# EAGLE design Beagle Cape (EAGLE 5.11)
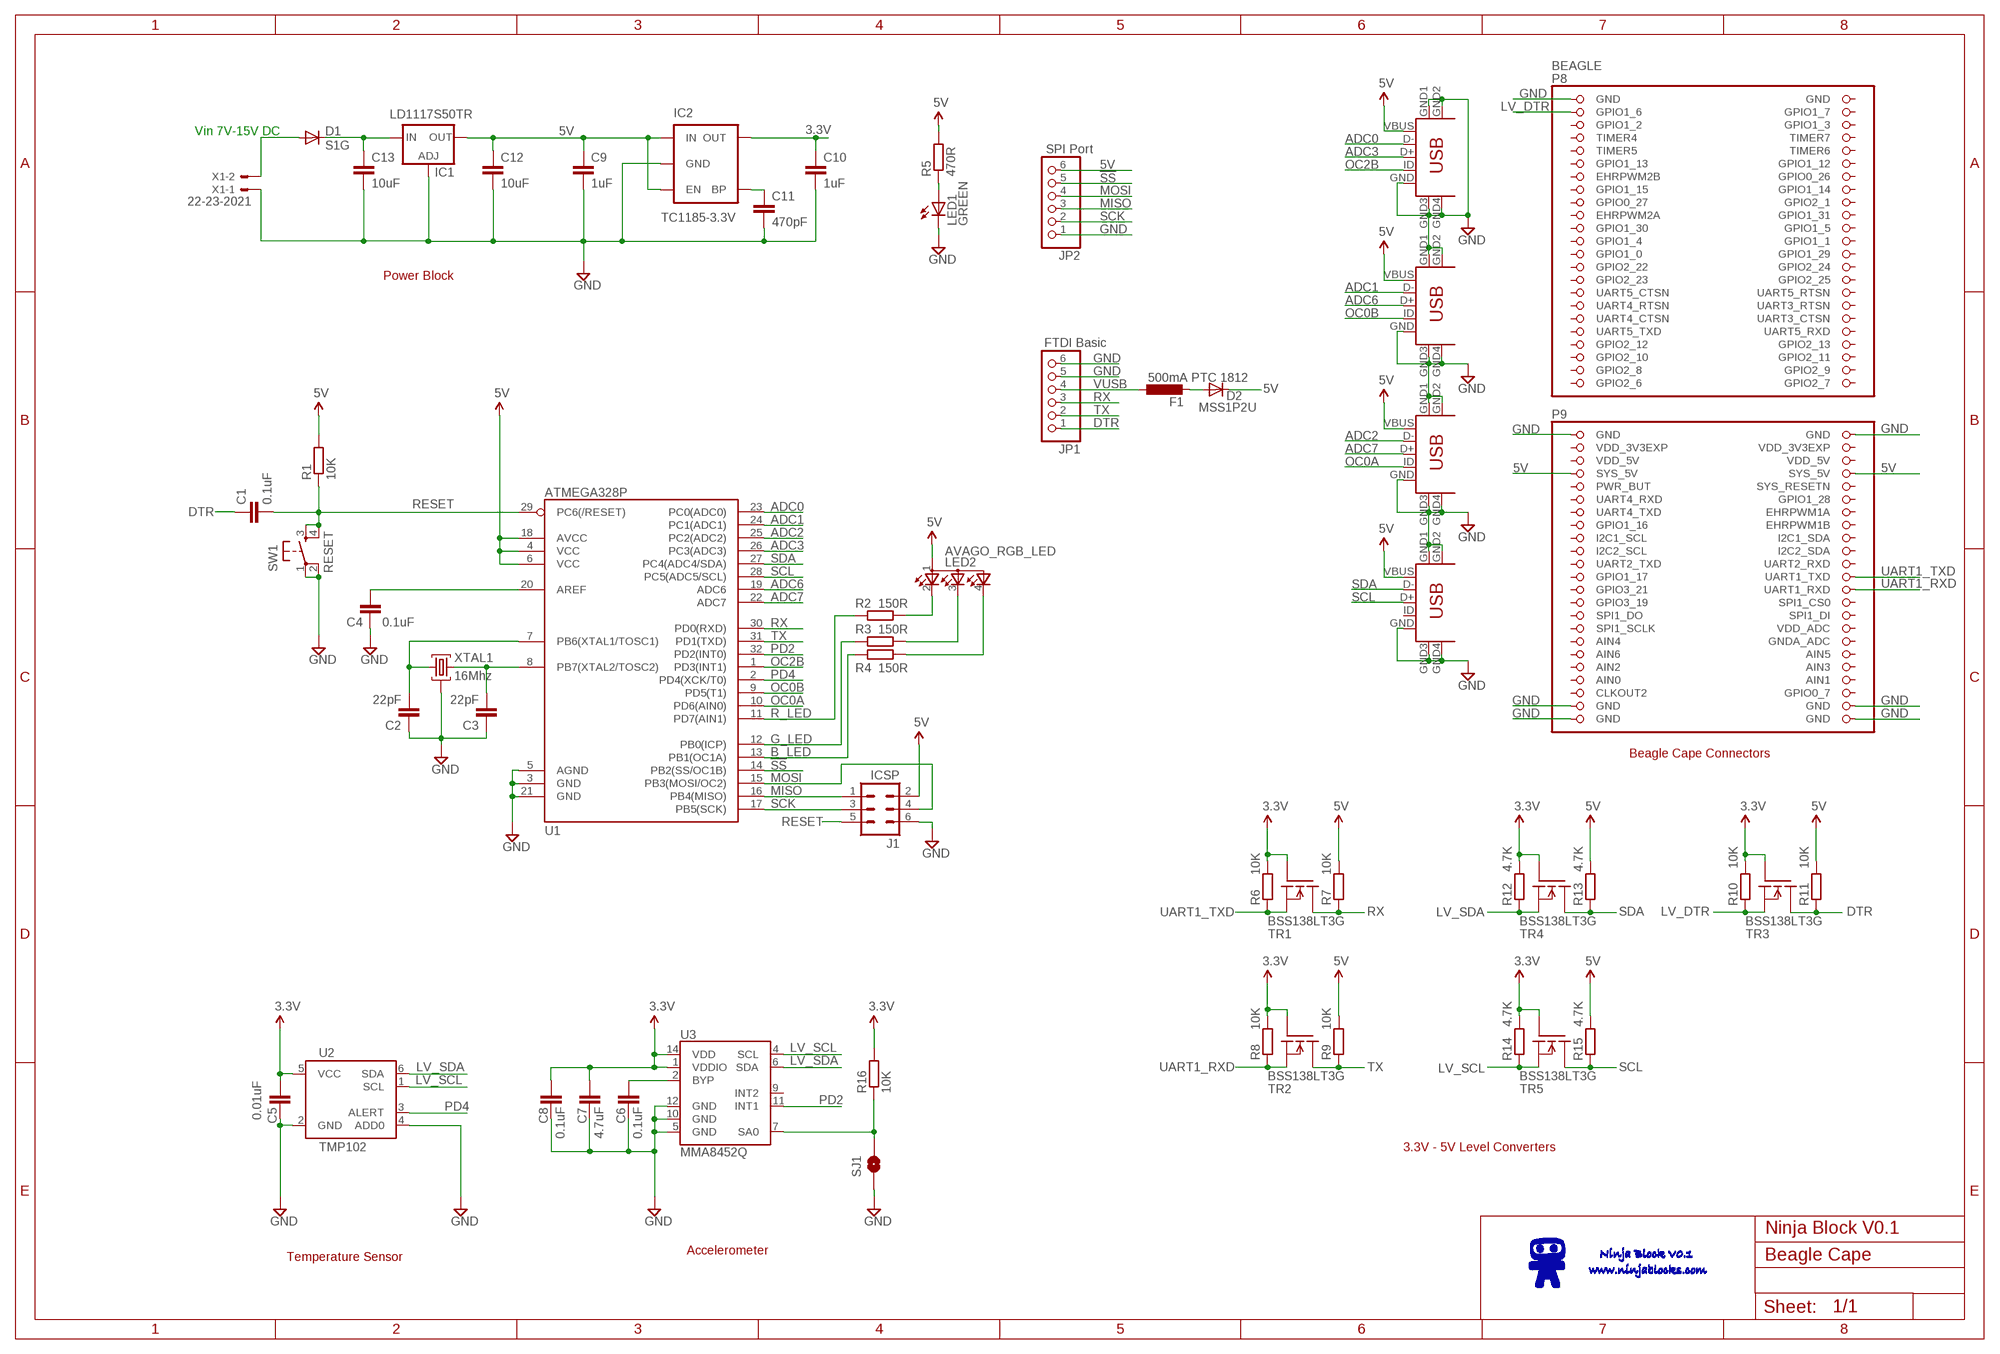
[diagram p0: schematic, sheet 1]

## Parts
BEAGLE  BEAGLEBONE_OUTLINE  [BEAGLEBONE_SHIELD]
C1  0.1uF  C-EUC0603  [C0603]
C2  22pF  C-EUC0603  [C0603]
C3  22pF  C-EUC0603  [C0603]
C4  0.1uF  C-EUC0603  [C0603]
C5  0.01uF  C-EUC0603  [C0603]
C6  0.1uF  C-EUC0603  [C0603]
C7  4.7uF  C-EUC0603  [C0603]
C8  0.1uF  C-EUC0603  [C0603]
C9  1uF  C-EUC0603  [C0603]
C10  1uF  C-EUC0603  [C0603]
C11  470pF  C-EUC0603  [C0603]
C12  10uF  C-EUC0603  [C0603]
C13  10uF  C-EUC1206  [C1206]
CON1  USB-MINIB  [MOLEX_MINIUSB_B]
CON2  USB-MINIB  [MOLEX_MINIUSB_B]
CON3  USB-MINIB  [MOLEX_MINIUSB_B]
D1  S1G  DIODESMA  [SMA-DIODE]
D2  MSS1P2U  [MICROSMP]
F1  500mA PTC 1812  L-EUL1812  [L1812]
I2C  USB-MINIB  [MOLEX_MINIUSB_B]
IC1  LD1117S50TR  LD117AS50TR  [SOT223]
IC2  TC1185-3.3V  V_REG_LDOSMD  [SOT23-5]
J1  ICSP  MA03-2  [MA03-2]
JP1  FTDI Basic  PINHD-1X6  [1X06]
JP2  SPI Port  PINHD-1X6  [1X06]
LED1  GREEN  LEDCHIPLED_0603  [CHIPLED_0603]
LED2  AVAGO_RGB_LED  [AVAGO_LED]
R1  10K  R-EU_R0603  [R0603]
R2  150R  R-EU_R0603  [R0603]
R3  150R  R-EU_R0603  [R0603]
R4  150R  R-EU_R0603  [R0603]
R5  470R  R-EU_R0603  [R0603]
R6  10K  R-EU_R0603  [R0603]
R7  10K  R-EU_R0603  [R0603]
R8  10K  R-EU_R0603  [R0603]
R9  10K  R-EU_R0603  [R0603]
R10  10K  R-EU_R0603  [R0603]
R11  10K  R-EU_R0603  [R0603]
R12  4.7K  R-EU_R0603  [R0603]
R13  4.7K  R-EU_R0603  [R0603]
R14  4.7K  R-EU_R0603  [R0603]
R15  4.7K  R-EU_R0603  [R0603]
R16  10K  R-EU_R0603  [R0603]
SJ1  SOLDERJUMPERNO  [SJ_2S-NO]
SW1  RESET  ALPS_SMD_TAC_SWITCH  [ALPS_SMD_TAC_SWITCH]
TR1  BSS138LT3G  IRLML2502PBF  [SOT23]
TR2  BSS138LT3G  IRLML2502PBF  [SOT23]
TR3  BSS138LT3G  IRLML2502PBF  [SOT23]
TR4  BSS138LT3G  IRLML2502PBF  [SOT23]
TR5  BSS138LT3G  IRLML2502PBF  [SOT23]
U1  ATMEGA328P  ATMEGA168  [TQFP32-08]
U2  TMP102  [SOT563]
U3  MMA8452Q  [QFN-16_0.5MM]
X1  22-23-2021  [22-23-2021]
XTAL1  16Mhz  12MHZ  [HC49US-G]

## Nets
3.3V: C5.2 C7.2 C8.2 C10.1 IC2.5(OUT) R6.1 R8.1 R10.1 R12.1 R14.1 R16.2 TR1.1(G) TR2.1(G) TR3.1(G) TR4.1(G) TR5.1(G) U2.5(VCC) U3.1(VDDIO) U3.14(VDD)
5V: BEAGLE.53(SYS_5V) BEAGLE.54(SYS_5V) C9.1 C12.1 CON1.VBUS CON2.VBUS CON3.VBUS D2.C I2C.VBUS IC1.4(OUT) IC2.1(IN) IC2.3(EN) J1.2 JP2.6 LED2.1(A1) R1.2 R5.2 R7.1 R9.1 R11.1 R13.1 R15.1 U1.4(VCC) U1.6(VCC) U1.18(AVCC)
!SS!: JP2.5 U1.14(PB2(SS/OC1B))
ADC0: CON1.D- U1.23(PC0(ADC0))
ADC1: CON2.D- U1.24(PC1(ADC1))
ADC2: CON3.D- U1.25(PC2(ADC2))
ADC3: CON1.D+ U1.26(PC3(ADC3))
ADC6: CON2.D+ U1.19(ADC6)
ADC7: CON3.D+ U1.22(ADC7)
B_LED: R4.2 U1.13(PB1(OC1A))
DTR: C1.1 JP1.1 R11.2 TR3.3(D)
G_LED: R3.2 U1.12(PB0(ICP))
GND: BEAGLE.1(GND) BEAGLE.47(GND) BEAGLE.48(GND) BEAGLE.89(GND) BEAGLE.90(GND) BEAGLE.91(GND) BEAGLE.92(GND) C2.1 C3.1 C4.1 C5.1 C6.1 C7.1 C8.1 C9.2 C10.2 C11.2 C12.2 C13.2 CON1.GND CON1.GND1(MTN1) CON1.GND2(MTN2) CON1.GND3(MTN3) CON1.GND4(MTN4) CON2.GND CON2.GND1(MTN1) CON2.GND2(MTN2) CON2.GND3(MTN3) CON2.GND4(MTN4) CON3.GND CON3.GND1(MTN1) CON3.GND2(MTN2) CON3.GND3(MTN3) CON3.GND4(MTN4) I2C.GND I2C.GND1(MTN1) I2C.GND2(MTN2) I2C.GND3(MTN3) I2C.GND4(MTN4) IC1.1(ADJ) IC2.2(GND) J1.6 JP1.5 JP1.6 JP2.1 LED1.C SJ1.1 SW1.1 SW1.2 U1.3(GND) U1.5(AGND) U1.21(GND) U2.2(GND) U2.4(ADD0) U3.5(GND) U3.10(GND) U3.12(GND) X1.1 XTAL1.GND
LV_DTR: BEAGLE.3(GPIO1_6) R10.2 TR3.2(S)
LV_SCL: R14.2 TR5.2(S) U2.1(SCL) U3.4(SCL)
LV_SDA: R12.2 TR4.2(S) U2.6(SDA) U3.6(SDA)
MISO: J1.1 JP2.3 U1.16(PB4(MISO))
MOSI: J1.4 JP2.4 U1.15(PB3(MOSI/OC2))
N$1: C2.2 U1.7(PB6(XTAL1/TOSC1)) XTAL1.1
N$2: LED2.2(R2) R2.1
N$3: C3.2 U1.8(PB7(XTAL2/TOSC2)) XTAL1.2
N$4: C4.2 U1.20(AREF)
N$5: LED2.3(G3) R3.1
N$6: LED2.4(B4) R4.1
N$9: R16.1 SJ1.2 U3.7(SA0)
N$10: C11.1 IC2.4(BP)
N$11: LED1.A R5.1
N$12: C13.1 D1.C IC1.3(IN)
N$13: C6.2 U3.2(BYP)
N$15: D1.A X1.2
N$16: D2.A F1.2
OC0A: CON3.ID U1.10(PD6(AIN0))
OC0B: CON2.ID U1.9(PD5(T1))
OC2B: CON1.ID U1.1(PD3(INT1))
PD2: U1.32(PD2(INT0)) U3.11(INT1)
PD4: U1.2(PD4(XCK/T0)) U2.3(ALERT)
R_LED: R2.2 U1.11(PD7(AIN1))
RESET: C1.2 J1.5 R1.1 SW1.3 SW1.4 U1.29(PC6(/RESET))
RX: JP1.3 R7.2 TR1.3(D) U1.30(PD0(RXD))
SCK: J1.3 JP2.2 U1.17(PB5(SCK))
SCL: I2C.D+ R15.2 TR5.3(D) U1.28(PC5(ADC5/SCL))
SDA: I2C.D- R13.2 TR4.3(D) U1.27(PC4(ADC4/SDA))
TX: JP1.2 R9.2 TR2.3(D) U1.31(PD1(TXD))
UART1_RXD: BEAGLE.72(UART1_RXD) R8.2 TR2.2(S)
UART1_TXD: BEAGLE.70(UART1_TXD) R6.2 TR1.2(S)
VUSB: F1.1 JP1.4
Unconnected: BEAGLE.5(GPIO1_2) BEAGLE.6(GPIO1_3) BEAGLE.7(TIMER4) BEAGLE.8(TIMER7) BEAGLE.9(TIMER5) BEAGLE.10(TIMER6) BEAGLE.11(GPIO1_13) BEAGLE.12(GPIO1_12) BEAGLE.13(EHRPWM2B) BEAGLE.14(GPIO0_26) BEAGLE.15(GPIO1_15) BEAGLE.16(GPIO1_14) BEAGLE.17(GPIO0_27) BEAGLE.18(GPIO2_1) BEAGLE.19(EHRPWM2A) BEAGLE.20(GPIO1_31) BEAGLE.21(GPIO1_30) BEAGLE.22(GPIO1_5) BEAGLE.23(GPIO1_4) BEAGLE.24(GPIO1_1) BEAGLE.25(GPIO1_0) BEAGLE.26(GPIO1_29) BEAGLE.27(GPIO2_22) BEAGLE.28(GPIO2_24) BEAGLE.29(GPIO2_23) BEAGLE.30(GPIO2_25) BEAGLE.31(UART5_CTSN) BEAGLE.32(UART5_RTSN) BEAGLE.33(UART4_RTSN) BEAGLE.34(UART3_RTSN) BEAGLE.35(UART4_CTSN) BEAGLE.36(UART3_CTSN) BEAGLE.37(UART5_TXD) BEAGLE.38(UART5_RXD) BEAGLE.39(GPIO2_12) BEAGLE.40(GPIO2_13) BEAGLE.41(GPIO2_10) BEAGLE.55(PWR_BUT) BEAGLE.56(SYS_RESETN) BEAGLE.57(UART4_RXD) BEAGLE.58(GPIO1_28) BEAGLE.59(UART4_TXD) BEAGLE.60(EHRPWM1A) BEAGLE.61(GPIO1_16) BEAGLE.62(EHRPWM1B) BEAGLE.63(I2C1_SCL) BEAGLE.64(I2C1_SDA) BEAGLE.65(I2C2_SCL) BEAGLE.66(I2C2_SDA) BEAGLE.67(UART2_TXD) BEAGLE.68(UART2_RXD) BEAGLE.69(GPIO1_17) BEAGLE.71(GPIO3_21) BEAGLE.73(GPIO3_19) BEAGLE.74(SPI1_CS0) BEAGLE.75(SPI1_DO) BEAGLE.76(SPI1_DI) BEAGLE.77(SPI1_SCLK) BEAGLE.78(VDD_ADC) BEAGLE.79(AIN4) BEAGLE.80(GNDA_ADC) BEAGLE.81(AIN6) BEAGLE.82(AIN5) BEAGLE.83(AIN2) BEAGLE.86(AIN1) BEAGLE.87(CLKOUT2) BEAGLE.88(GPIO0_7) I2C.ID U3.9(INT2)

## Notes on the sheet
- Vin 7V-15V DC
- Power Block
- Beagle Cape Connectors
- 3.3V - 5V Level Converters
- Ninja Block V0.1
- Accelerometer
- Temperature Sensor

## Power pins joined to a net without a drawn wire
AIN0: BEAGLE.85(AIN0)
AIN3: BEAGLE.84(AIN3)
GND: BEAGLE.2(GND)
GPIO1_7: BEAGLE.4(GPIO1_7)
GPIO2_6: BEAGLE.45(GPIO2_6)
GPIO2_7: BEAGLE.46(GPIO2_7)
GPIO2_8: BEAGLE.43(GPIO2_8)
GPIO2_9: BEAGLE.44(GPIO2_9)
GPIO2_11: BEAGLE.42(GPIO2_11)
VDD_3V3EXP: BEAGLE.49(VDD_3V3EXP) BEAGLE.50(VDD_3V3EXP)
VDD_5V: BEAGLE.51(VDD_5V) BEAGLE.52(VDD_5V)

## Library data of the parts
BEAGLE = adafruit:BEAGLEBONE_OUTLINE: Should match A3 pinout - but not completely tested
C1-C13 = rcl:C-EU: CAPACITOR, European symbol
CON1-CON3 I2C = SparkFun:USB-MINIB: Mini-USB "B" connector with 5th pin broken out. Created new symbol breaking out 5th "ID" pin in mini/micro USB connector spec. See: http://en.wikipedia.org/wiki/Mini_usb#Cables. Uses same footprint as 4-pin symbol. Also added pins to connect to mounting / shield pads if required (probably not generally needed as signals aren't shielded once they leave the connector).
D1 = SparkFun:DIODE: Diode These are standard reverse protection diodes and small signal diodes. SMA package can handle up to about 1A. SOD-323 can handle about 200mA. What the SOD-323 package when ordering, there are some mfgs out there that are 5-pin packages.
D2 = Monkey:MSS1P2U: MSS1P2U-M3/89A Schottky Rectifier Datasheet : http://www.vishay.com/docs/89020/mss1p3l.pdf
F1 = rcl:L-EU: INDUCTOR, European symbol
IC1 = v-reg:LD117A?*: Low drop fixed and adjustable positive voltage regulators 1 A Source: http://www.st.com/stonline/products/literature/ds/7194/ld1117axx.pdf
IC2 = SparkFun:V_REG_LDO: Voltage Regulator LDO Standard 150mA LDO voltage regulator in SOT-23 layout. Micrel part MIC5205. BP (by-pass) pin is used to lower output noise with 470pF cap.
J1 = con-lstb:MA03-2: PIN HEADER; OC_FARNELL: unknown; OC_NEWARK: unknown
JP1 JP2 = pinhead:PINHD-1X6: PIN HEADER
LED1 = led:LED: LED OSRAM: - CHIPLED LG R971, LG N971, LY N971, LG Q971, LY Q971, LO R971, LY R971 LH N974, LH R974 LS Q976, LO Q976, LY Q976 LO Q996 - Hyper CHIPLED LW Q18S LB Q993, LB Q99A, LB R99A - SideLED LS A670, LO A670, LY A670, LG A670, LP A670 LB A673, LV A673, LT A673, LW A673 LH A674 LY A675 LS A676, LA A676, LO A676, LY A676, LW A676 LS A679, LY A679, LG A679 - Hyper Micro SIDELED® LS Y876, LA Y876, LO Y876, LY Y876 LT Y87S - SmartLED LW L88C, LW L88S LB L89C, LB L89S, LG L890 LS L89K, LO L89K, LY L89K LS L896, LA L896, LO L896, LY L896 - TOPLED LS T670, LO T670, LY T670, LG T670, LP T670 LSG T670, LSP T670, LSY T670, LOP T670, LYG T670 LG T671, LOG T671, LSG T671 LB T673, LV T673, LT T673, LW T673 LH T674 LS T676, LA T676, LO T676, LY T676, LB T676, LH T676, LSB T676, LW T676 LB T67C, LV T67C, LT T67C, LS T67K, LO T67K, LY T67K, LW E67C LS E67B, LA E67B, LO E67B, LY E67B, LB E67C, LV E67C, LT E67C LW T67C LS T679, LY T679, LG T679 LS T770, LO T770, LY T770, LG T770, LP T770 LB T773, LV T773, LT T773, LW T773 LH T774 LS E675, LA E675, LY E675, LS T675 LS T776, LA T776, LO T776, LY T776, LB T776 LHGB T686 LT T68C, LB T68C - Hyper Mini TOPLED® LB M676 - Mini TOPLED Santana® LG M470 LS M47K, LO M47K, LY M47K Source: http://www.osram.convergy.de LUXEON: - LUMILED® LXK2-PW12-R00, LXK2-PW12-S00, LXK2-PW14-U00, LXK2-PW14-V00 LXK2-PM12-R00, LXK2-PM12-S00, LXK2-PM14-U00 LXK2-PE12-Q00, LXK2-PE12-R00, LXK2-PE12-S00, LXK2-PE14-T00, LXK2-PE14-U00 LXK2-PB12-K00, LXK2-PB12-L00, LXK2-PB12-M00, LXK2-PB14-N00, LXK2-PB14-P00, LXK2-PB14-Q00 LXK2-PR12-L00, LXK2-PR12-M00, LXK2-PR14-Q00, LXK2-PR14-R00 LXK2-PD12-Q00, LXK2-PD12-R00, LXK2-PD12-S00 LXK2-PH12-R00, LXK2-PH12-S00 LXK2-PL12-P00, LXK2-PL12-Q00, LXK2-PL12-R00 Source: www.luxeon.com KINGBRIGHT: KA-3528ASYC Source: www.kingbright.com
LED2 = Monkey:AVAGO_RGB_LED
R1-R16 = resistor:R-EU_: RESISTOR, European symbol
SJ1 = SparkFun:SOLDERJUMPER: Solder Jumper Standard SMD solder jumper. Used to automate production. Two varients : Normally Open and Normally Closed are the same, but have different paste layers. NC will have a large amount of paste and should jumper during reflow.
SW1 = Monkey:ALPS_SMD_TAC_SWITCH: ALPS SMD Tactile Switch SKQGAKE010 Source : http://www.farnell.com/datasheets/78970.pdf
TR1-TR5 = Monkey:IRLML2502PBF: IRLML2502 N-Channel HexFet Power Mosfet Datasheet : http://www.irf.com/product-info/datasheets/data/irlml2502pbf.pdf
U1 = SparkFun:ATMEGA168
U2 = SparkFun:TMP102
U3 = SparkFun:MMA8452Q: MMA8452Q 3-Axis, 12/8-bit Digital Accelerometer Supply Voltage: 1.6-3.6V Range: +/- 2g, 4g, 8g Interface: I2C, 12-bit and 8-bit ODR: 1.56 Hz - 800 Hz Package: QFN-16 http://cache.freescale.com/files/sensors/doc/data_sheet/MMA8452Q.pdf
X1 = con-molex:22-23-2021: .100" (2.54mm) Center Header - 2 Pin; MF: MOLEX; MPN: 22-23-2021; OC_FARNELL: 1462926; OC_NEWARK: 25C3832
XTAL1 = Monkey:12MHZ: HC/49US (AT49) 3RD LEAD CASE-GROUNDED SMD LOW PROFILE CRYSTAL CRYSTAL, 12MHz, 18pF, HC-49/US Source : http://www.abracon.com/Resonators/ABLSG.pdf

## Board
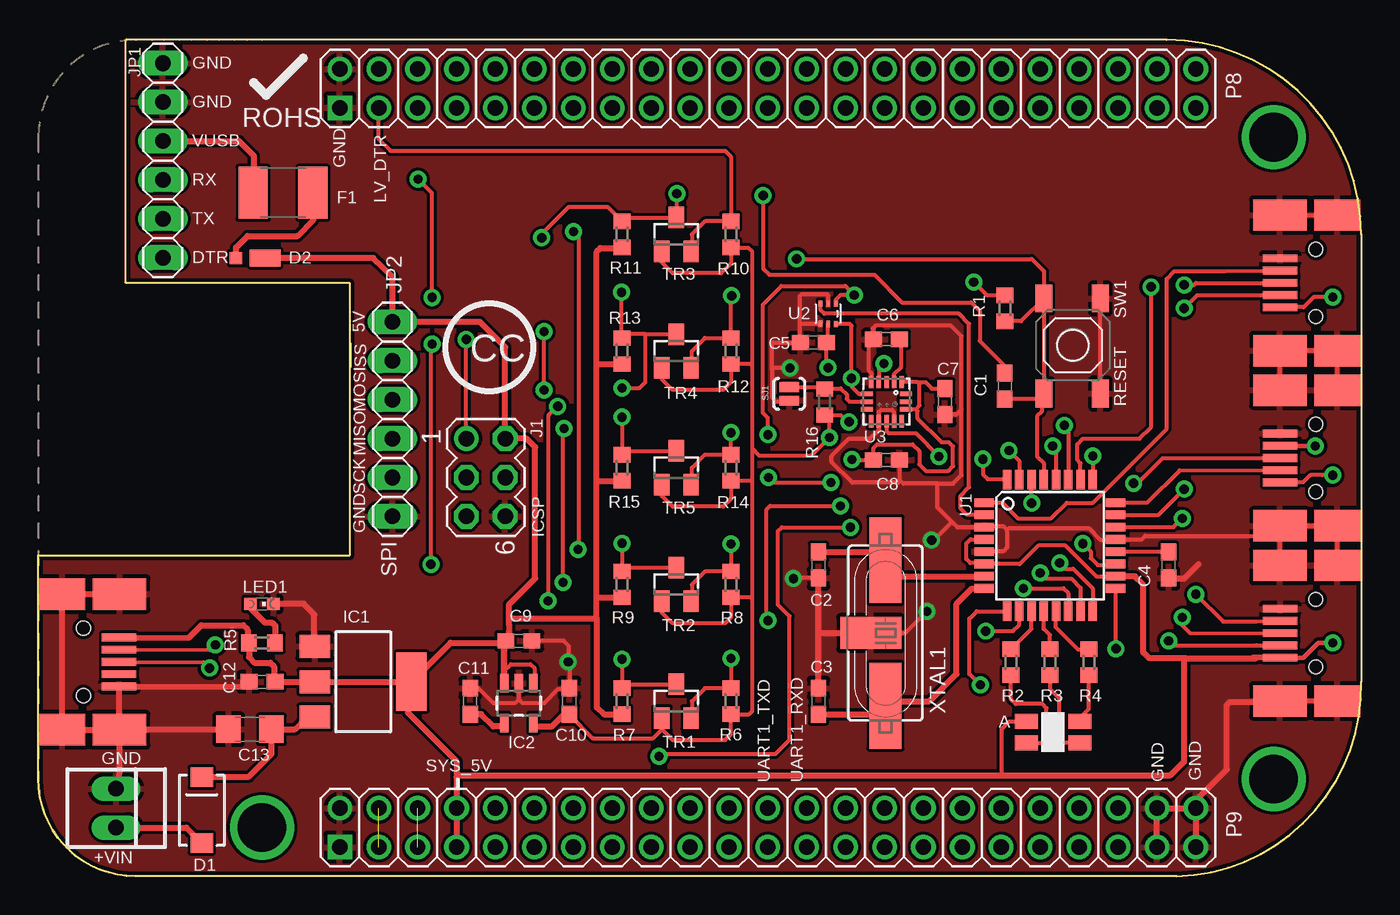
[diagram p1: board, top side]
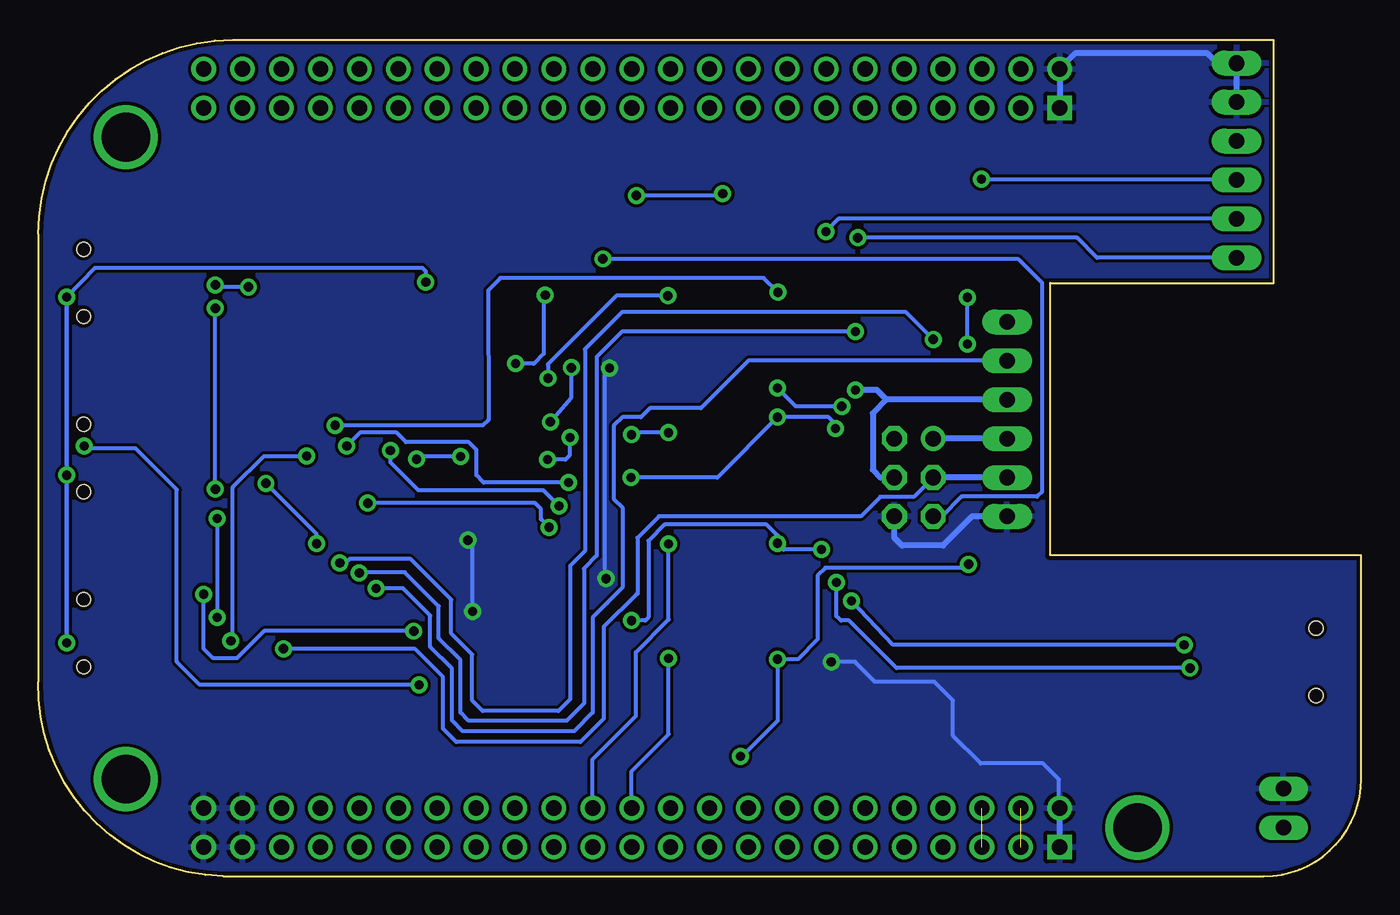
[diagram p2: board, bottom side, seen from below]

Size 86.36 x 54.61 mm. Coordinates in mm from the lower left corner, seen from the top.
Copper layers (1*16): Top 0.035mm / dielectric 1.5mm / Bottom 0.035mm
Design rules "SparkFun": minimum track width 8mil, minimum drill 20mil, track to track 8mil, track to pad 8mil, pad to pad 8mil, via to via 8mil, smd to smd 8mil, copper to edge 10mil, drill to drill 8mil, minimum pad ring 12mil, minimum via ring 10mil, stop-mask expansion 4mil, vias tented up to drill 25mil, thermal gap 10mil

### Footprints (pad centres in the part's own frame; a part is rotated, then mirrored left to right if it is on the bottom)
BEAGLEBONE_SHIELD = drill 1 square: 1 19.685,50.165; 47 19.685,1.905 | drill 1 round: 2 19.685,52.705; 3 22.225,50.165; 4 22.225,52.705; 5 24.765,50.165; 6 24.765,52.705; 7 27.305,50.165; 8 27.305,52.705; 9 29.845,50.165; 10 29.845,52.705; 11 32.385,50.165; 12 32.385,52.705; 13 34.925,50.165; 14 34.925,52.705; 15 37.465,50.165; 16 37.465,52.705; 17 40.005,50.165; 18 40.005,52.705; 19 42.545,50.165; 20 42.545,52.705; 21 45.085,50.165; 22 45.085,52.705; 23 47.625,50.165; 24 47.625,52.705; 25 50.165,50.165; 26 50.165,52.705; 27 52.705,50.165; 28 52.705,52.705; 29 55.245,50.165; 30 55.245,52.705; 31 57.785,50.165; 32 57.785,52.705; 33 60.325,50.165; 34 60.325,52.705; 35 62.865,50.165; 36 62.865,52.705; 37 65.405,50.165; 38 65.405,52.705; 39 67.945,50.165; 40 67.945,52.705; 41 70.485,50.165; 42 70.485,52.705; 43 73.025,50.165; 44 73.025,52.705; 45 75.565,50.165; 46 75.565,52.705; 48 19.685,4.445; 49 22.225,1.905; 50 22.225,4.445; 51 24.765,1.905; 52 24.765,4.445; 53 27.305,1.905; 54 27.305,4.445; 55 29.845,1.905; 56 29.845,4.445; 57 32.385,1.905; 58 32.385,4.445; 59 34.925,1.905; 60 34.925,4.445; 61 37.465,1.905; 62 37.465,4.445; 63 40.005,1.905; 64 40.005,4.445; 65 42.545,1.905; 66 42.545,4.445; 67 45.085,1.905; 68 45.085,4.445; 69 47.625,1.905; 70 47.625,4.445; 71 50.165,1.905; 72 50.165,4.445; 73 52.705,1.905; 74 52.705,4.445; 75 55.245,1.905; 76 55.245,4.445; 77 57.785,1.905; 78 57.785,4.445; 79 60.325,1.905; 80 60.325,4.445; 81 62.865,1.905; 82 62.865,4.445; 83 65.405,1.905; 84 65.405,4.445; 85 67.945,1.905; 86 67.945,4.445; 87 70.485,1.905; 88 70.485,4.445; 89 73.025,1.905; 90 73.025,4.445; 91 75.565,1.905; 92 75.565,4.445 | drill 3.175 round: P$1 14.605,3.175; P$2 80.645,6.35; P$3 80.645,48.26
C0603 = smd 1.1 x 1: 1 -0.85,0; 2 0.85,0
C1206 = smd 1.6 x 1.8: 1 -1.4,0; 2 1.4,0
MOLEX_MINIUSB_B = smd 2.25 x 0.5: D+ 2.325,-0.005; D- 2.325,0.795; GND 2.325,-1.605; ID 2.325,-0.805; VBUS 2.325,1.595 | smd 3 x 2.05: GND1 -1.4,-4.43; GND3 -1.4,4.42 | smd 3.5 x 2.05: GND2 2.35,-4.43; GND4 2.35,4.42 | hole 0.9: 0,-2.205; 0,2.195
SMA-DIODE = smd 1.27 x 1.47: A -2.15,0; C 2.15,0
MICROSMP = smd 0.8 x 0.8: A 1.9,0 | smd 2 x 1.1: C 0,0
L1812 = smd 1.9 x 3.4: 1 -1.95,0; 2 1.95,0
SOT223 = smd 1.5 x 2: 1 -2.3,-3.15; 2 0,-3.15; 3 2.3,-3.15 | smd 3.8 x 2: 4 0,3.15
SOT23-5 = smd 0.55 x 1.2: 1 -0.95,-1.3; 2 0,-1.3; 3 0.95,-1.3; 4 0.95,1.3; 5 -0.95,1.3
MA03-2 = drill 1.016 round: 1 -2.54,-1.27 | drill 1.016 octagon: 2 -2.54,1.27; 3 0,-1.27; 4 0,1.27; 5 2.54,-1.27; 6 2.54,1.27
1X06 = drill 1.016 long: 1 -6.35,0; 2 -3.81,0; 3 -1.27,0; 4 1.27,0; 5 3.81,0; 6 6.35,0
CHIPLED_0603 = smd 0.8 x 0.8: A 0,-0.75; C 0,0.75
AVAGO_LED = smd 1.5 x 1: 1 3.5,0; 2 3.5,1.4; 3 0,1.4; 4 0,0
R0603 = smd 1 x 1.1: 1 -0.85,0; 2 0.85,0
SJ_2S-NO = smd 0.635 x 1.27: 1 -0.45,0; 2 0.45,0
ALPS_SMD_TAC_SWITCH = smd 1.8 x 1.1: 1 0,3.7; 2 6.2,3.7; 3 0,0; 4 6.2,0
SOT23 = smd 1 x 1.4: 1 -0.95,-1.1; 2 0.95,-1.1; 3 0,1.1
TQFP32-08 = smd 1.27 x 0.559: 1 -4.293,2.8; 2 -4.293,2; 3 -4.293,1.2; 4 -4.293,0.4; 5 -4.293,-0.4; 6 -4.293,-1.2; 7 -4.293,-2; 8 -4.293,-2.8; 17 4.293,-2.8; 18 4.293,-2; 19 4.293,-1.2; 20 4.293,-0.4; 21 4.293,0.4; 22 4.293,1.2; 23 4.293,2; 24 4.293,2.8 | smd 0.559 x 1.27: 9 -2.8,-4.293; 10 -2,-4.293; 11 -1.2,-4.293; 12 -0.4,-4.293; 13 0.4,-4.293; 14 1.2,-4.293; 15 2,-4.293; 16 2.8,-4.293; 25 2.8,4.293; 26 2,4.293; 27 1.2,4.293; 28 0.4,4.293; 29 -0.4,4.293; 30 -1.2,4.293; 31 -2,4.293; 32 -2.8,4.293
SOT563 = smd 0.25 x 0.4: 1 -0.5,-0.66; 2 0,-0.66; 3 0.5,-0.66; 4 0.5,0.66; 5 0,0.66; 6 -0.5,0.67
QFN-16_0.5MM = smd 0.8 x 0.3: 1 -1.275,1; 2 -1.275,0.5; 3 -1.275,0; 4 -1.275,-0.5; 5 -1.275,-1; 9 1.275,-1; 10 1.275,-0.5; 11 1.275,0; 12 1.275,0.5; 13 1.275,1 | smd 0.3 x 0.8: 6 -0.5,-1.275; 7 0,-1.275; 8 0.5,-1.275; 14 0.5,1.275; 15 0,1.275; 16 -0.5,1.275
22-23-2021 = drill 1 long: 1 -1.27,0; 2 1.27,0
HC49US-G = smd 5.6 x 2.1: 1 -11.74,0.95; 2 -2.24,0.95 | smd 2.1 x 4: GND -6.99,0

### Placement (x,y rotation side)
BEAGLE  0,0 0 top
C1  63.09,32 270 top
C2  50.93,20.32 90 top
C3  50.93,11.43 270 top
C4  73.79,20.32 90 top
C5  50.6,34.85 0 top
C6  55.37,35.05 0 top
C7  59.18,30.99 90 top
C8  55.37,27.18 180 top
C9  31.37,15.37 0 top
C10  34.67,11.43 90 top
C11  28.19,11.43 90 top
C12  14.61,12.7 180 top
C13  13.82,9.6 180 top
CON1  83.4,38.73 180 top
CON2  83.4,27.3 180 top
CON3  83.4,15.87 180 top
D1  10.67,4.32 90 top
D2  14.81,40.36 180 top
F1  15.98,44.63 0 top
I2C  2.95,14 0 top
IC1  21.21,12.7 270 top
IC2  31.37,11.3 180 top
J1  29.21,26.04 270 top
JP1  8.13,46.74 90 top
JP2  23.11,29.84 90 top
LED1  14.61,17.78 270 top
LED2  68,10.11 180 top
R1  63.09,37.08 90 top
R2  63.5,13.97 90 top
R3  66.04,13.97 90 top
R4  68.58,13.97 90 top
R5  14.61,15.24 180 top
R6  45.21,11.43 90 top
R7  38.1,11.43 90 top
R8  45.21,19.05 90 top
R9  38.1,19.05 90 top
R10  45.21,41.91 90 top
R11  38.1,41.91 90 top
R12  45.21,34.29 90 top
R13  38.1,34.29 90 top
R14  45.21,26.67 90 top
R15  38.1,26.67 90 top
R16  51.33,30.96 270 top
SJ1  49.02,31.5 90 top
SW1  65.63,37.72 270 top
TR1  41.66,11.43 0 top
TR2  41.66,19.05 0 top
TR3  41.66,41.91 0 top
TR4  41.66,34.29 0 top
TR5  41.66,26.67 0 top
U1  66.04,21.59 0 top
U2  51.56,36.73 180 top
U3  55.37,30.99 270 top
X1  5.08,4.45 270 top
XTAL1  54.36,8.89 270 top

### Tracks (layer width: path | path; a pad name or v marks a point on that pad's centre or on a via)
3.3V  (via drill 0.6)
  Top 0.254: C7.2 58.33,31.84 57.91,32.26 57.4,32.26 | 57.4,32.26 U3.1 | 57.28,30.49 U3.14 | 57.28,30.49 57.53,30.73 57.53,32.13 57.4,32.26 | TR3.1 40.71,40.71 40.64,40.64 40.64,40.13 41.4,39.37 44.58,39.37 45.21,40.01 R10.1 45.25,41.02 46.35,41.02 46.61,40.77 46.61,33.53 | TR4.1 40.71,32.45 41.4,31.75 44.7,31.75 45.21,32.26 R12.1 46.52,33.44 46.61,33.53 | TR5.1 40.71,24.83 41.4,24.13 44.7,24.13 45.21,24.64 R14.1 46.52,25.82 46.61,25.91 | TR2.1 40.71,17.21 41.4,16.51 44.83,16.51 45.21,16.89 R8.1 46.52,18.2 46.61,18.29 | 40.71,9.59 TR1.1 | 40.71,9.59 41.4,8.89 44.83,8.89 45.21,9.27 R6.1 46.39,10.58 46.61,10.79 46.61,18.29 | C10.1 34.67,10.54 36.2,9.02 40.14,9.02 40.71,9.59 | 46.61,18.29 46.61,25.91 | 46.61,25.91 46.61,27.91 | 57.28,30.49 57.4,30.37 57.4,29.9 58.98,28.32 59.44,28.32 59.72,28.07 59.72,26.77 59.41,26.47 57.94,26.47 57.51,26.9 57.51,27.76 57.07,28.19 54.76,28.19 54.52,27.95 C8.2 53.34,27.18 v53.11,27.2 | R16.2 51.63,30.07 | 46.61,27.91 46.61,33.53 | 46.61,27.91 47.04,27.48 50.47,27.48 v51.64,28.65 51.64,30.06 R16.2 | R16.2 51.59,30.11 | v52.93,29.67 52.81,29.67 52.38,30.1 51.35,30.1 R16.2 | v51.56,33.2 51.45,33.31 C5.2 51.56,34.96 U2.5
  Top 0.406: C10.1 34.33,10.58 33.53,9.78 32.54,9.78 IC2.5
  Bottom 0.254: v51.56,33.2 51.56,31.27 v52.93,29.67 | v53.11,27.2 51.94,27.2 51.69,27.46 51.69,28.6 v51.64,28.65
5V  (via drill 0.6)
  Top 0.254: U1.4 60.85,21.99 60.58,21.72 60.58,20.7 60.83,20.45 61.69,20.45 U1.6 64.08,20.39 65.28,21.59 67.06,21.59 69.09,19.56 70.3,19.56 U1.18 | IC2.3 30.42,13.4 30.86,13.84 32.13,13.84 32.38,13.59 32.38,12.67 IC2.1 | 30.61,15.46 30.73,16.38 | 38.06,41.02 R11.1 | LED2.1 63.37,10.11 62.89,9.63 62.89,6.71 62.99,6.6 | 79.49,14.22 CON3.VBUS | R1.2 61.91,37.93 v61.06,38.79 | v84.5,37.82 83.27,37.82 82.6,37.15 CON1.VBUS | CON2.VBUS 82.56,25.71 83.04,26.19 83.79,26.19 v84.5,26.19
  Top 0.305: CON3.VBUS 82.58,14.27 83.55,15.24 v84.5,15.24
  Top 0.406: IC1.4 24.36,11.46 24.16,11.46 24.13,11.43 24.13,10.67 27.3,7.49 27.3,6.48 | 27.3,6.48 BEAGLE.54 BEAGLE.53 | IC1.4 26.9,15.24 30.48,15.24 30.42,15.18 IC2.3 30.42,15.27 C9.1 30.61,15.46 30.73,15.58 30.73,16.38 30.73,16.74 | R7.1 36.92,10.58 36.45,11.02 36.45,16.84 | 38.06,41.02 36.7,41.02 36.45,40.77 36.45,33.53 | 79.3,14.28 CON3.VBUS 81.05,14.28 | 27.3,6.48 27.43,6.6 62.99,6.6 73.91,6.6 74.8,7.49 74.8,14.1 74.93,14.22 | U1.18 71.6,19.59 72.14,19.05 72.14,14.61 72.52,14.22 74.93,14.22 | 30.73,16.74 30.73,17.75 32.44,19.46 32.44,28.02 31.88,28.57 J1.2 30.48,34.54 28.83,36.2 JP2.6 23.11,39.14 21.87,40.36 D2.C | IC1.4 C12.1 15.39,12.76 15.39,13.69 15.14,13.95 14.12,13.95 13.76,14.31 R5.2 13.66,15.33 13.66,16.1 13.39,16.38 10.64,16.38 9.83,15.57 I2C.VBUS | 36.45,18.24 36.45,25.7 | 36.45,25.7 36.45,33.53 | R13.1 36.54,33.44 36.45,33.53 | R15.1 36.56,25.82 36.45,25.7 | R9.1 36.49,18.2 36.45,18.24 | 36.45,16.84 36.45,18.24 | 36.45,16.84 30.89,16.84 30.73,16.74 | 74.93,14.22 79.49,14.22 | CON2.VBUS 81.13,25.7 | CON1.VBUS 81.05,37.13
  Bottom 0.254: v61.06,38.79 61.06,39.5 61.29,39.73 82.65,39.73 v84.5,37.82
  Bottom 0.305: v84.5,37.82 v84.5,26.19 v84.5,15.24
!SS!  (via drill 0.6)
  Top 0.254: U1.14 67.24,18.48 66.93,18.8 v64.31,18.8
  Bottom 0.254: JP2.5 40.01,33.66 43.1,30.56 46.43,30.56 47.02,29.97 48.23,29.97 48.79,29.41 48.79,24.64 48.23,24.08 48.23,18.85 49.23,17.86 49.23,17.83 50.16,16.89 50.16,10.69 51.38,9.47 58.65,9.47 59.36,10.19 59.36,13.56 60.78,14.99 60.78,17.02 62.56,18.8 v64.31,18.8
ADC0  (via drill 0.6)
  Top 0.254: U1.23 73.12,23.59 v74.8,25.27 | CON1.D- 75.65,37.94 v74.8,37.08
  Bottom 0.254: v74.8,25.27 v74.8,37.08
ADC1
  Top 0.254: U1.24 72.4,24.39 74.51,26.5 CON2.D-
ADC2  (via drill 0.6)
  Top 0.254: U1.25 v68.84,27.43 v68.83,27.43 | v73.79,15.37 73.84,15.37 74.12,15.09 79.53,15.09 CON3.D-
  Bottom 0.254: v68.83,27.43 71.63,27.43 73.66,25.4 73.66,15.49 v73.79,15.37
ADC3  (via drill 0.6)
  Top 0.254: U1.26 68.04,26.96 67.82,27.18 67.82,28.19 68.2,28.57 71.88,28.57 72.64,29.34 v72.64,38.48 | v74.8,38.61 75.44,38.61 75.56,38.73 CON1.D+
  Bottom 0.254: v72.64,38.48 74.68,38.48 v74.8,38.61
ADC6  (via drill 0.6)
  Top 0.254: U1.19 69.92,20.39 69.85,20.32 69.16,20.32 68.71,20.78 68.71,21.21 v68.2,21.72 | v71.5,25.65 71.75,25.65 73.41,27.3 CON2.D+
  Bottom 0.254: v68.2,21.72 68.2,22.35 v71.5,25.65
ADC7  (via drill 0.6)
  Top 0.254: U1.22 74.1,22.79 v74.68,23.37 | v74.68,16.89 74.68,16.38 75.18,15.88 CON3.D+
  Bottom 0.254: v74.68,23.37 v74.68,16.89
B_LED
  Top 0.254: R4.2 67.86,14.82 66.42,16.26 66.42,17.19 U1.13
DTR  (via drill 0.6)
  Top 0.254: C1.1 63.09,33.33 61.47,34.95 61.47,36.91 60.91,37.47 56.39,37.47 54.59,39.27 47.73,39.27 47.32,39.67 v47.32,44.45 47.37,44.4 | v41.68,44.58 41.68,43.03 TR3.3 38.35,43.01 R11.2 37.15,43.71 34.65,43.71 32.87,41.94 v32.87,41.68
  Bottom 0.254: v47.32,44.45 41.81,44.45 v41.68,44.58 | JP1.1 17.25,40.39 18.54,41.68 v32.87,41.68
G_LED
  Top 0.254: U1.12 65.64,16.15 66.04,15.75 R3.2
GND  (via drill 0.6)
  Top 0.254: SW1.2 SW1.1 | 63.25,22.61 62.99,22.86 62.23,22.86 62.16,22.79 U1.3 59.99,22.79 59.65,23.13 | 63.25,22.61 63.25,21.46 62.99,21.21 61.77,21.21 U1.5 | C11.2 28.74,12.28 29.72,11.3 31.11,11.3 31.37,11.56 | 31.37,11.56 IC2.2 | 31.37,11.56 31.62,11.3 33.02,11.3 33.91,12.19 34.58,12.19 C10.2 34.67,13.92 v34.59,13.99 34.65,14.05 34.65,15.01 34.29,15.37 C9.2 | 63.25,22.61 63.37,22.73 68.58,22.73 69.34,21.97 70.31,21.97 U1.21 72.03,21.99 72.26,22.23 80.39,22.23 | U3.5 54.37,32.85 54.2,33.02 54.2,34.73 C6.1 54.48,35.09 54.48,35.76 54.63,35.92 54.63,35.94 59.59,35.94 60.27,35.26 60.27,30.48 | 60.27,30.48 60.27,26.19 59.72,25.63 58.75,25.63 | 58.75,25.63 56.46,25.63 56.26,25.83 | 56.26,25.83 56.26,27.14 C8.1 | 59.65,23.13 58.7,24.08 58.7,25.58 58.75,25.63 | C7.1 59.93,30.14 60.27,30.48 | SJ1.1 48.96,30.99 48.16,30.99 47.9,31.24 47.9,33.09 | C2.1 49.62,19.47 v49.3,19.43 | 56.26,25.83 56.13,25.7 53.14,25.7 51.79,27.05 51.79,27.43 52.93,28.57 54.3,28.57 54.86,29.13 U3.10 54.87,30.31 55.02,30.45 55.75,30.45 55.85,30.35 55.85,29.73 U3.12 | XTAL1.GND 56.6,15.88 v58.01,17.3 | v58.32,21.95 58.47,21.95 59.65,23.13 | CON1.GND2 CON1.GND1 | U2.2 51.56,37.92 51.49,38 49.84,38 49.71,37.87 49.71,36.07 | v49.07,33.17 47.99,33.17 47.9,33.09 | 49.71,36.07 49.71,34.89 C5.1 47.98,34.85 47.9,34.77 47.9,33.09 | 49.71,36.07 U2.4 | 49.71,36.07
  Top 0.305: 80.39,22.23 CON2.GND4 | CON2.GND4 CON3.GND2 | CON2.GND4 CON2.GND3 CON3.GND1 | CON3.GND4 CON3.GND3 | CON2.GND1 CON1.GND3 CON1.GND4 CON2.GND2
  Top 0.406: 17.54,15 IC1.1 18.01,15.05 18.01,17.09 17.32,17.78 LED1.C | C3.1 50.93,15.88 | 50.93,15.88 C2.1 | XTAL1.GND 50.93,15.88 | I2C.GND 13.43,12.37 C12.2 | 75.75,20.38 74.8,19.43 73.83,19.43 C4.1 | BEAGLE.89 BEAGLE.90 BEAGLE.92 | BEAGLE.92 BEAGLE.91 | BEAGLE.92 75.56,4.95 77.6,6.99 77.6,11.2 77.78,11.38 81.05,11.38 CON3.GND4 | I2C.GND2 I2C.GND1 I2C.GND3 I2C.GND4 | X1.1 5.25,5.71 I2C.GND2 | I2C.GND 5.25,12.38 | C13.2 6,9.6 6,9 5.25,9 I2C.GND2 | I2C.GND2 5.28,9.57 I2C.GND
  Bottom 0.254: v34.59,13.99 33.05,13.99 31.75,12.7 27.86,12.7 26.64,11.48 26.64,9.17 24.84,7.37 20.78,7.37 19.74,6.33 19.74,4.5 BEAGLE.48 | v49.3,19.43 49.38,19.63 49.38,32.87 v49.07,33.17 | v58.01,17.3 58.01,21.64 v58.32,21.95
  Bottom 0.406: JP2.1 25.4,23.5 27.3,21.59 29.97,21.59 30.48,22.1 J1.6 | BEAGLE.47 BEAGLE.48 | BEAGLE.1 BEAGLE.2 18.67,53.72 10.03,53.72 9.4,53.09 JP1.6 JP1.5
  pour Top: -5.08,58.42 -5.08,-5.08 88.9,-5.08 88.9,-3.81 88.9,58.42
  pour Bottom: -5.08,58.42 88.9,58.42 88.9,-5.08 -5.08,-5.08 -5.08,-2.54
LV_DTR
  Top 0.254: TR3.2 42.67,40.88 42.67,41.91 43.52,42.76 R10.2 45.21,46.99 44.83,47.37 22.99,47.37 22.23,48.13 BEAGLE.3
LV_SCL  (via drill 0.6)
  Top 0.254: TR5.2 42.67,25.64 42.67,26.67 43.52,27.52 R14.2 v45.21,28.96 | U3.4 54.87,33.16 v55.2,33.47 | U2.1 52.06,37.63 52.38,37.95 v53.26,37.95 52.68,38.53 48.51,38.53 47.3,37.31 47.3,30.25 47.62,29.92 v47.62,28.83
  Bottom 0.254: v55.2,33.47 54.03,33.47 54.01,33.47 53.37,34.11 53.37,37.85 v53.26,37.95 | v45.21,28.96 47.5,28.96 v47.62,28.83
LV_SDA  (via drill 0.6)
  Top 0.254: TR4.2 42.67,33.26 42.67,34.29 43.52,35.14 R12.2 45.21,37.85 v45.26,37.9 | U3.6 53.58,31.49 53.09,31.98 v53.09,32.51 53.09,35.94 52.96,36.07 52.07,36.07 U2.6
  Bottom 0.254: v45.26,37.9 48.62,37.9 53.09,33.43 v53.09,32.51
MISO  (via drill 0.6)
  Top 0.254: U1.16 68.84,18.79 67.56,20.07 67.06,20.07 v66.67,20.45 | J1.1 v27.94,35.05
  Bottom 0.254: v66.67,20.45 66.29,20.45 66.04,20.7 62.05,20.7 59.41,18.06 59.41,15.85 58.04,14.48 58.04,11.48 57.35,10.79 52.4,10.79 51.64,11.56 51.64,20.27 50.67,21.23 50.67,34.42 48.26,36.83 29.72,36.83 v27.94,35.05
  Bottom 0.406: JP2.3 J1.1
MOSI  (via drill 0.6)
  Top 0.254: U1.15 68.04,18.83 67.44,19.43 65.79,19.43 v65.41,19.81 | v33.02,31.75 v33.02,35.56
  Bottom 0.254: v33.02,35.56 48.26,35.56 49.91,33.91 49.91,20.93 50.75,20.09 50.75,11.28 51.87,10.16 58.27,10.16 58.8,10.69 58.8,14.12 60.22,15.54 60.22,17.63 62.43,19.84 65.38,19.84 v65.41,19.81
  Bottom 0.406: JP2.4 30.99,31.11 | 30.99,31.11 31.88,30.23 31.88,26.54 31.37,26.04 J1.4 | v33.02,31.75 31.62,31.75 30.99,31.11
N$1
  Top 0.406: C2.2 54.77,21.17 XTAL1.1 55.37,20.56 55.37,19.56 55.4,19.59 U1.7
N$2
  Top 0.254: LED2.2 65.58,8.71 65.81,8.94 65.81,10.97 65.53,11.25 63.8,11.25 63.5,11.56 R2.1
N$3
  Top 0.406: C3.2 54.76,10.58 XTAL1.2 55.61,11.43 58.17,11.43 59.94,13.21 59.94,17.78 60.95,18.79 U1.8
N$4
  Top 0.254: U1.20 73.77,21.19 C4.2
N$5
  Top 0.254: LED2.3 66.83,8.71 66.65,8.89 66.65,11.61 66.06,12.19 66.06,13.1 R3.1
N$6
  Top 0.254: LED2.4 68,10.34 68.58,10.92 R4.1
N$9
  Top 0.254: SJ1.2 51.45,31.95 R16.1 51.58,31.85 52.38,31.85 52.78,31.45 52.78,31.17 52.96,30.99 U3.7
N$10
  Top 0.406: C11.1 28.92,10.58 29.72,9.78 30.2,9.78 IC2.4
N$11
  Top 0.406: LED1.A 13.86,17.49 14.78,16.56 15.27,16.56 15.47,16.36 15.47,15.25 R5.1
N$12
  Top 0.406: D1.C 10.7,6.5 13.74,6.5 15.22,7.98 C13.1 16.76,9.6 17.56,10.4 IC1.3
N$13
  Top 0.254: U3.2 55.87,32.78 56.34,33.25 56.34,34.68 C6.2
N$15
  Top 0.406: X1.2 9.66,3.17 D1.A
N$16
  Top 0.406: D2.A 12.91,41.05 13.66,41.81 16.92,41.81 17.96,42.85 17.96,44.6 F1.2
OC0A  (via drill 0.6)
  Top 0.254: U1.10 64.04,16.41 63.63,16 v61.85,16 | CON3.ID 79.5,16.64 77.34,16.64 v75.56,18.41
  Bottom 0.254: v61.85,16 71.63,16 73.41,14.22 74.93,14.22 75.56,14.86 v75.56,18.41
OC0B  (via drill 0.6)
  Top 0.254: U1.9 61.27,17.3 60.78,16.82 60.78,13.21 v61.49,12.5 | 81.52,28.11 CON2.ID
  Top 0.305: 81.52,28.11 83.35,28.11 v83.37,28.08
  Bottom 0.254: v61.49,12.5 75.82,12.5 77.32,13.99 77.32,25.25 80.01,27.94 83.23,27.94 v83.37,28.08
OC2B
  Top 0.254: CON1.ID 77.47,39.5 74.17,39.5 73.66,38.99 73.66,29.21 68.83,24.38 67.13,24.38 66.12,23.37 63.96,23.37 62.94,24.39 U1.1
PD2  (via drill 0.6)
  Top 0.254: U3.11 55.37,29.06 55.5,28.93 57.28,28.93 v58.8,27.41 | v61.67,27.23 61.67,26.24 61.98,25.93 63.19,25.93 U1.32
  Bottom 0.254: v58.8,27.41 61.49,27.41 v61.67,27.23
PD4
  Top 0.254: U2.3 51.06,36.97 51.31,36.73 60.1,36.73 60.76,36.07 60.76,25.4 60.2,24.84 60.2,24 60.58,23.62 61.72,23.62 U1.2
R_LED
  Top 0.254: U1.11 64.84,16.16 R2.2
RESET  (via drill 0.6)
  Top 0.254: SW1.3 SW1.4 65.27,31.15 | R1.1 64.15,36.23 SW1.3 | 65.27,31.15 C1.2 | U1.29 65.64,26.97 65.2,27.41 65.2,30.05 65.51,30.35 65.51,30.92 65.27,31.15 | v49.51,40.31 64.85,40.31 65.66,39.5 65.66,37.74 SW1.3
  Top 0.406: SW1.4 65.74,31.41
  Bottom 0.254: J1.5 27.38,23.5 26.09,24.79 21.16,24.79 20.83,25.12 20.83,38.73 22.38,40.28 49.48,40.28 v49.51,40.31
RX  (via drill 0.6)
  Top 0.254: TR1.3 38.35,12.53 R7.2 v38.1,14.17 | v25.63,20.37 25.63,34.67 v25.7,34.75 | v25.7,37.8 25.7,44.6 v24.79,45.52 | U1.30 v64.84,24.36 v64.85,24.36 | v53.01,22.78 48.54,22.78 48.28,22.53 48.28,17.73 49.05,16.97 49.05,8.91 48.11,7.98 40.82,7.98 v40.51,7.82
  Bottom 0.254: v25.63,20.37 25.86,20.14 34.98,20.14 35.48,19.63 35.48,15.47 36.78,14.17 v38.1,14.17 38.1,10.16 40.44,7.82 v40.51,7.82 | v25.7,34.75 v25.7,37.8 | v24.79,45.52 8.18,45.52 JP1.3 | v64.85,24.36 53.92,24.36 53.54,23.98 53.54,23.32 v53.01,22.78
SCK  (via drill 0.6)
  Top 0.254: U1.17 70.33,14.88 v70.36,14.86
  Bottom 0.254: J1.3 29.21,24.77 31.39,24.77 32.66,23.5 45.85,23.5 47.24,22.1 47.24,18.41 47.32,18.41 49.45,16.28 49.45,10.29 50.98,8.76 59.08,8.76 59.94,9.63 59.94,13.03 61.75,14.83 70.33,14.83 v70.36,14.86
  Bottom 0.406: JP2.2 J1.3
SCL  (via drill 0.6)
  Top 0.254: I2C.D+ 10.79,13.97 v11.18,13.59 | v38.1,29.97 R15.2 38.35,27.77 TR5.3 | U1.28 66.44,27.87 v66.22,28.09 | v51.74,25.7 47.95,25.7 v47.68,26.04 | v34.27,19.18 34.27,29.18 v34.31,29.23
  Bottom 0.254: v47.68,26.04 42.04,26.04 v38.1,29.97 | v11.18,13.59 30.33,13.59 33.43,16.69 33.96,16.69 34.27,16.99 v34.27,19.18 | v38.1,29.97 38.05,29.92 | v34.31,29.23 34.31,29.52 34.77,29.97 v38.1,29.97 | v51.74,25.7 57.28,25.7 57.76,26.19 57.76,27.84 58.27,28.35 62.36,28.35 62.97,28.96 65.35,28.96 v66.22,28.09
SDA  (via drill 0.6)
  Top 0.254: 39.62,35.39 38.35,35.39 R13.2 38.08,35.16 v38.08,38.12 | 39.62,35.39 TR4.3 41.68,35.41 | I2C.D- 11.21,14.77 v11.56,15.11 | v38.1,31.88 39.24,31.88 39.62,32.26 39.62,35.39 | U1.27 67.24,29.08 v66.98,29.44 | v33.91,30.68 33.33,30.1 33.33,17.93 v33.27,17.98
  Bottom 0.254: v66.98,29.44 57.35,29.44 56.97,29.79 57,38.25 56.19,39.06 39.01,39.06 v38.08,38.12 | v38.1,31.88 36.91,30.68 v33.91,30.68 | v11.56,15.11 30.56,15.11 v33.27,17.98
TX  (via drill 0.6)
  Top 0.254: TR2.3 38.35,20.15 R9.2 v38.1,21.74 | v34.95,42.09 34.95,42.04 35.28,41.71 35.28,21.39 v35.23,21.34 | U1.31 64.04,27.12 v63.37,27.79 | v52.38,24.18 47.78,24.18 47.55,23.95 47.55,16.84 v47.62,16.69
  Bottom 0.254: JP1.2 34.11,42.93 v34.95,42.09 | v63.37,27.79 63.37,27.03 61.54,25.2 53.39,25.2 v52.38,24.18 | v47.62,16.69 46.74,16.69 46.53,16.89 46.53,21.89 45.47,22.96 38.81,22.96 38.1,22.25 v38.1,21.74 37.69,21.34 v35.23,21.34
UART1_RXD  (via drill 0.6)
  Top 0.254: TR2.2 42.67,18.02 42.67,19.05 43.52,19.9 R8.2 v45.21,21.69
  Bottom 0.254: v45.21,21.69 45.21,16.76 47.35,14.63 47.35,10.46 50.16,7.64 BEAGLE.72
UART1_TXD  (via drill 0.6)
  Top 0.254: TR1.2 42.67,10.4 42.67,11.43 43.52,12.28 R6.2 v45.21,14.22
  Bottom 0.254: BEAGLE.70 47.62,6.86 45.21,9.27 v45.21,14.22
VDD_3V3EXP  (1 unrouted)
VDD_5V  (1 unrouted)
VUSB
  Top 0.406: JP1.4 13.11,48.01 14.07,47.04 14.07,44.67 F1.1

### Text on the board
tPlace: GND | P8 | GND | ROHS | VUSB | LV_DTR | GND | RX | TX | DTR | 5V | U2 | CC | !SS! | MOSI | MISO | SCK | GND | SPI | ICSP | A | GND | SYS_5V | UART1_TXD | UART1_RXD | GND | GND | P9 | +VIN